# Altium schematic sheet Current_Driver_1.SchDoc
size A
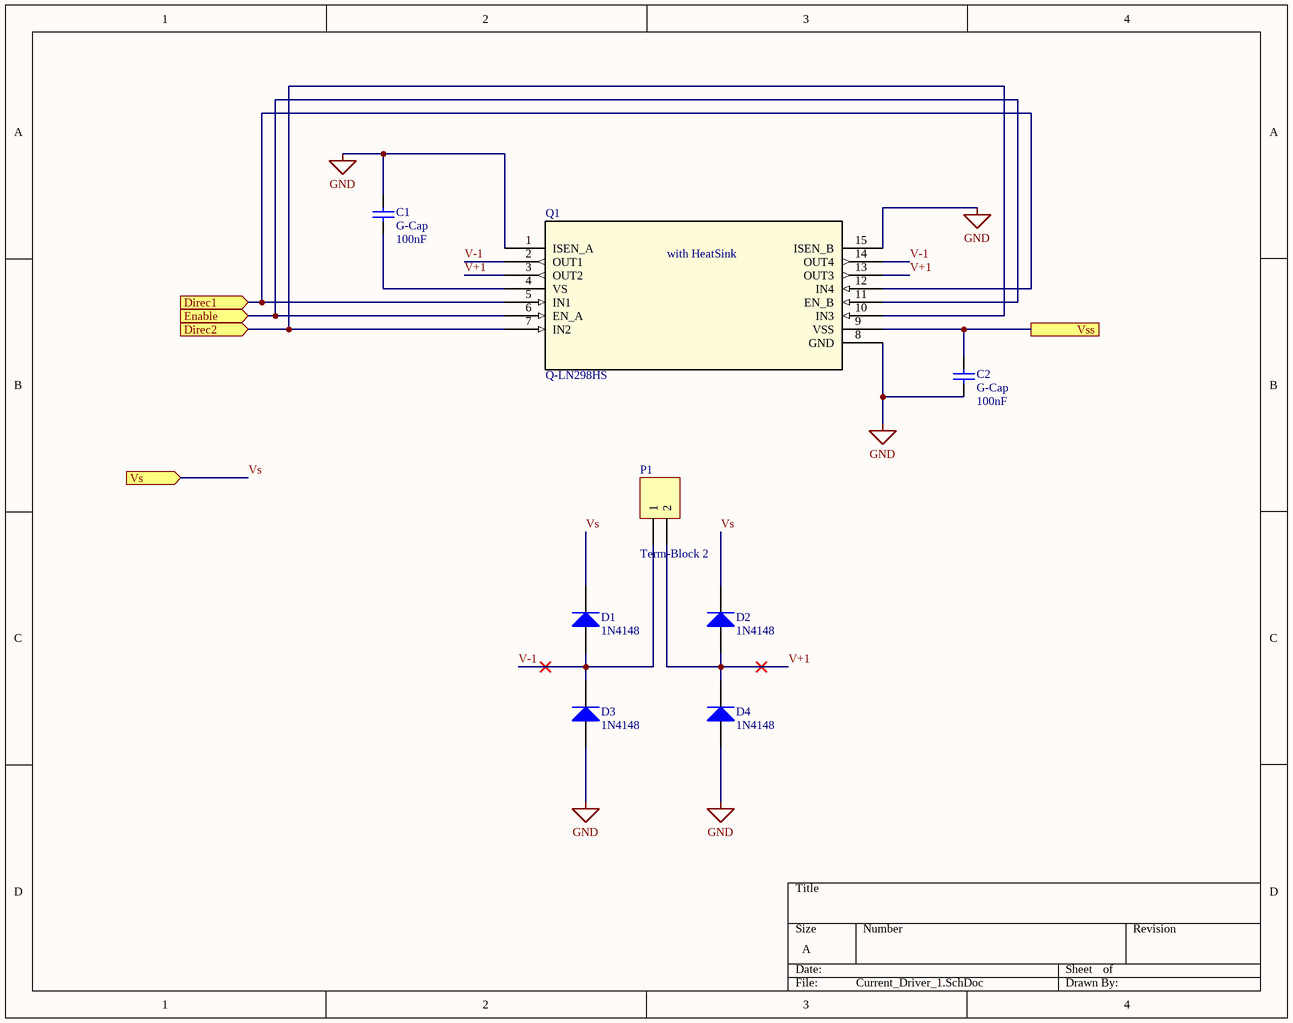
[diagram p0: Current_Driver_1.SchDoc]

## Parts
C1  G-Cap  value 100nF  [Cap2.54mm_LGE1.0]
C2  G-Cap  value 100nF  [Cap2.54mm_LGE1.0]
D1  1N4148  [DO-41_XLGE1.2]
D2  1N4148  [DO-41_XLGE1.2]
D3  1N4148  [DO-41_XLGE1.2]
D4  1N4148  [DO-41_XLGE1.2]
P1  Term-Block 2  [TERM-BLOCK-5.08MM-2POS]
Q1  Q-LN298HS  [Multiwatt15_V_ELEC391HS]

## Ports
Direc1 (in), Direc2 (in), Enable (in), Vs (in), Vss

## Nets
GND: C1.2 C2.1 D3.1(A) D4.1(A) Q1.1(ISEN_A) Q1.8(GND) Q1.15(ISEN_B)
Direc1: Q1.5(IN1) Q1.12(IN4) ; port Direc1
Direc2: Q1.7(IN2) Q1.10(IN3) ; port Direc2
Enable: Q1.6(EN_A) Q1.11(EN_B) ; port Enable
V+1: D2.1(A) D4.2(K) P1.2 Q1.3(OUT2) Q1.13(OUT3)
V-1: D1.1(A) D3.2(K) P1.1 Q1.2(OUT1) Q1.14(OUT4)
Vs: D1.2(K) D2.2(K) ; port Vs
Vss: C2.2 Q1.9(VSS) ; port Vss
NetC1_1: C1.1 Q1.4(VS)

## Notes on the sheet
- (in symbol Q-LN298HS) with HeatSink

## Library data of the parts
C1 C2 = G-Cap: Capacitor (specify value); Published: 8-Jun-2000; LatestRevisionDate: 17-Jul-2002; LatestRevisionNote: Re-released for DXP Platform.; PackageReference: RAD-0.3; Publisher: Altium Limited
D1-D4 = T-DiodeRect: High-speed Diode; ComponentLink1URL: http://www.mccsemi.com/up_pdf/1N4148(DO-35).pdf; ComponentLink1Description: Datasheet (ELEC391)
P1 = C-Block2: Terminal-Block 1x2; LatestRevisionDate: 17-Jul-2002; LatestRevisionNote: Re-released for DXP Platform.; Publisher: Altium Limited
Q1 = Q-LN298HS: LN298 - IC Bridge Driver Par 15Multiwatt; Manufacturer_Part_Number: L298N; Vendor: ST Microelectronics; Input Type: Non-Inverting; Number of Outputs: 4; Current - Output / Channel: 2A; Current - Peak Output: 3A; Voltage - Supply: 4.5 V ~ 46 V; C: Copyright (C) 2015 Accelerated Designs. All rights reserved; Quantity_Available: 5651; DataSheet: http://www.st.com/internet/com/TECHNICAL_RESOURCES/TECHNICAL_LITERATURE/DATASHEET/CD00000240.pdf; Type: Type; On-State Resistance: -; Operating Temperature: -25Â°C ~ 130Â°C; Mounting Type: Through Hole; Package / Case: Multiwatt-15 (Vertical, Bent and Staggered Leads); Supplier Device Package: 15-Multiwatt; Packaging: Tube; Copyright: Copyright (C) 2015 Accelerated Designs. All rights reserved; RefDes: RefDes; Value: Value; ComponentLink1URL: http://www.st.com/content/ccc/resource/technical/document/datasheet/82/cc/3f/39/0a/29/4d/f0/CD00000240.pdf/files/CD00000240.pdf/jcr:content/translations/en.CD00000240.pdf; ComponentLink1Description: Datasheet (ELEC391)